# EAGLE schematic ESP01 Breakout (EAGLE 6.5.0)
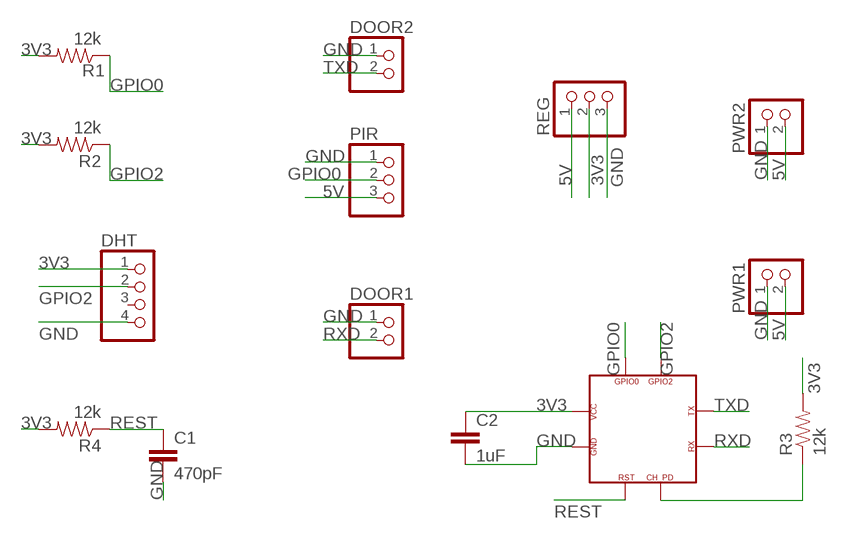
[diagram p0: schematic, sheet 1]

## Parts
C1  470pF  CAPEZ  [CAP-PTH-SMALLEZ]
C2  1uF  CAPEZ  [CAP-PTH-SMALLEZ]
DHT  PINHD-1X4  [1X04]
DOOR1  PINHD-1X2/90  [1X02/90]
DOOR2  PINHD-1X2/90  [1X02/90]
PIR  PINHD-1X3  [1X03]
PWR1  PINHD-1X2/90  [1X02/90]
PWR2  PINHD-1X2/90  [1X02/90]
R1  12k  RESISTORPTH-1/4W  [AXIAL-0.4]
R2  12k  RESISTORPTH-1/4W  [AXIAL-0.4]
R3  12k  RESISTORPTH-1/4W  [AXIAL-0.4]
R4  12k  RESISTORPTH-1/4W  [AXIAL-0.4]
REG  PINHD-1X3  [1X03]
U$2  ESP-01  [ESP-01]

## Nets
3V3: C2.1 DHT.1 R1.P$2 R2.P$2 R3.P$2 R4.P$2 REG.2 U$2.VCC
5V: PIR.3 PWR1.2 PWR2.2 REG.1
GND: C1.2 C2.2 DHT.4 DOOR1.1 DOOR2.1 PIR.1 PWR1.1 PWR2.1 REG.3 U$2.GND
GPIO0: PIR.2 R1.P$1 U$2.GPIO0
GPIO2: DHT.2 R2.P$1 U$2.GPIO2
N$3: R3.P$1 U$2.CH_PD(CP_PD)
REST: C1.1 R4.P$1 U$2.RST
RXD: DOOR1.2 U$2.RXD(RX)
TXD: DOOR2.2 U$2.TXD(TX)
Unconnected: DHT.3

## Library data of the parts
C1 C2 = SparkFun-Capacitors:CAP: Capacitor Standard 0603 ceramic capacitor, and 0.1" leaded capacitor.
DHT = pinhead:PINHD-1X4: PIN HEADER
DOOR1 DOOR2 PWR1 PWR2 = pinhead:PINHD-1X2: PIN HEADER
PIR REG = pinhead:PINHD-1X3: PIN HEADER
R1-R4 = SparkFun-Passives:RESISTOR: Resistor Basic schematic elements and footprints for 0603, 1206, and PTH resistors.
U$2 = Franc:ESP-01

## Net classes
0 default: width 0.406 mm, clearance 0.406 mm